# Altium schematic sheet IT66121FN.SchDoc
size A3; Author: Nguyễn Hữu Thắng; DrawnBy: Nguyễn Hữu Thắng; SheetNumber: 30; SheetTotal: 31
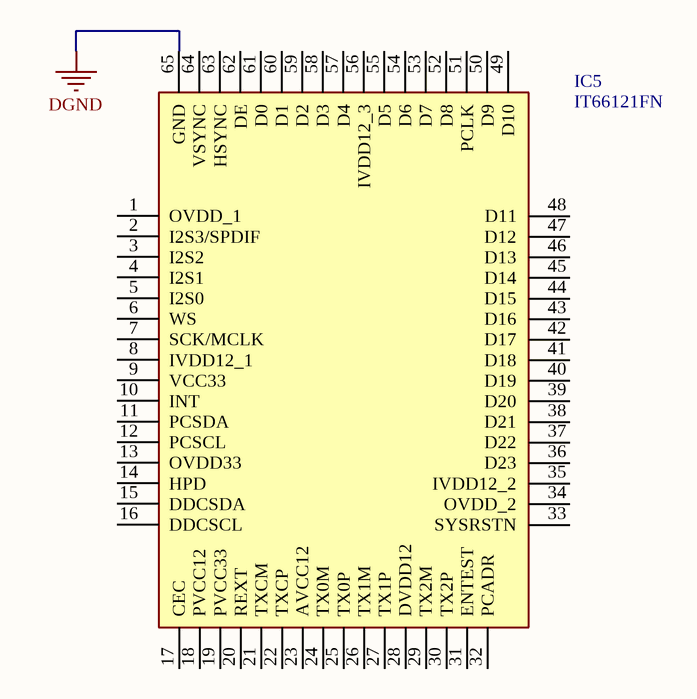
[diagram p0: IT66121FN.SchDoc]

## Parts
IC5  IT66121FN  [QFN50P900X900X100-65N-D]

## Nets
DGND: IC5.65(GND)

Not connected (* = marked no-connect by the designer): IC5 1(OVDD_1) 2(I2S3/SPDIF) 3(I2S2) 4(I2S1) 5(I2S0) 6(WS) 7(SCK/MCLK) 8(IVDD12_1) 9(VCC33) 10(INT) 11(PCSDA) 12(PCSCL) 13(OVDD33) 14(HPD) 15(DDCSDA) 16(DDCSCL) 17(CEC) 18(PVCC12) 19(PVCC33) 20(REXT) 21(TXCM) 22(TXCP) 23(AVCC12) 24(TX0M) 25(TX0P) 26(TX1M) 27(TX1P) 28(DVDD12) 29(TX2M) 30(TX2P) 31(ENTEST) 32(PCADR) 33(SYSRSTN) 34(OVDD_2) 35(IVDD12_2) 36(D23) 37(D22) 38(D21) 39(D20) 40(D19) 41(D18) 42(D17) 43(D16) 44(D15) 45(D14) 46(D13) 47(D12) 48(D11) 49(D10) 50(D9) 51(PCLK) 52(D8) 53(D7) 54(D6) 55(D5) 56(IVDD12_3) 57(D4) 58(D3) 59(D2) 60(D1) 61(D0) 62(DE) 63(HSYNC) 64(VSYNC)

## Library data of the parts
IC5 = IT66121FN: Integrated Circuit; Manufacturer_Name: ITE; Datasheet Link: https://datasheetspdf.com/pdf-file/808171/ITETECH/IT66121FN/1; Height: 1mm; Manufacturer_Part_Number: IT66121FN